# Altium schematic sheet 24V Step Up Voltage Regulator U3V50F24.SchDoc
size A
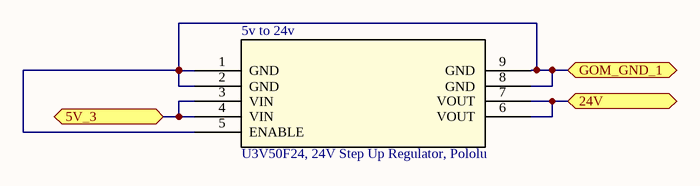
[diagram p0: 24V Step Up Voltage Regulator U3V50F24.SchDoc]

## Parts
5v_to_24v  U3V50F24, 24V Step Up Regulator, Pololu  [U3V50F24]

## Ports
5V_3, 24V, GOM_GND_1

## Nets
5V_3: 5v_to_24v.3(VIN) 5v_to_24v.4(VIN) ; port 5V_3
24V: 5v_to_24v.6(VOUT) 5v_to_24v.7(VOUT) ; port 24V
GOM_GND_1: 5v_to_24v.1(GND) 5v_to_24v.2(GND) 5v_to_24v.5(ENABLE) 5v_to_24v.8(GND) 5v_to_24v.9(GND) ; port GOM_GND_1

## Library data of the parts
5v_to_24v = U3V50F24, 24V Step Up Regulator, Pololu: 4V Step Up Regulator